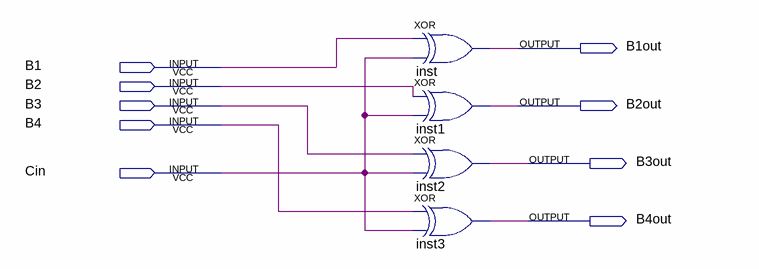
[diagram p0: schematic sheet]
// Quartus schematic inversor4bits.bdf as structural Verilog: 4 symbols, 9 pins
module inversor4bits (
  input  B1,
  input  B2,
  input  B3,
  input  B4,
  input  Cin,
  output B1out,
  output B2out,
  output B3out,
  output B4out
);

  xor inst (B1out, B1, Cin);
  xor inst1 (B2out, B2, Cin);
  xor inst2 (B3out, B3, Cin);
  xor inst3 (B4out, B4, Cin);
endmodule
